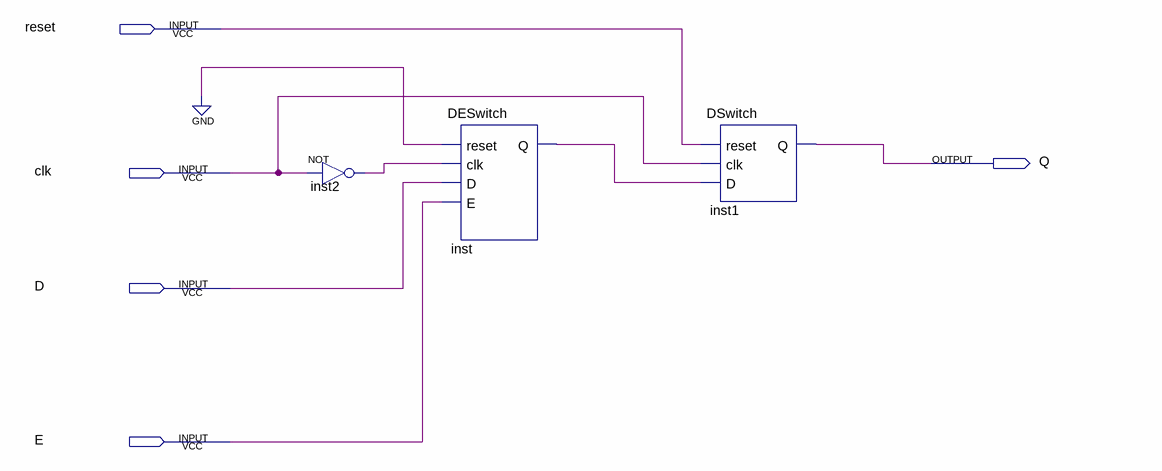
[diagram p0: schematic sheet]
// Quartus schematic flopenr.bdf as structural Verilog: 3 symbols, 5 pins
module flopenr (
  input  reset,
  input  clk,
  input  D,
  input  E,
  output Q
);

  wire inst2_out, inst_q;

  not inst2 (inst2_out, clk);
  DESwitch inst (.reset(1'b0), .clk(inst2_out), .D(D), .E(E), .Q(inst_q));
  DSwitch inst1 (.reset(reset), .clk(clk), .D(inst_q), .Q(Q));
endmodule
